# Altium schematic sheet SENSORS_FMU3_REV_C.SchDoc: Pixhawk_mini_8L.sch
size A4; Date: 18/08/2014 1:53:16 PM; DrawnBy: Philip Rowse; SheetNumber: 4; SheetTotal: 10
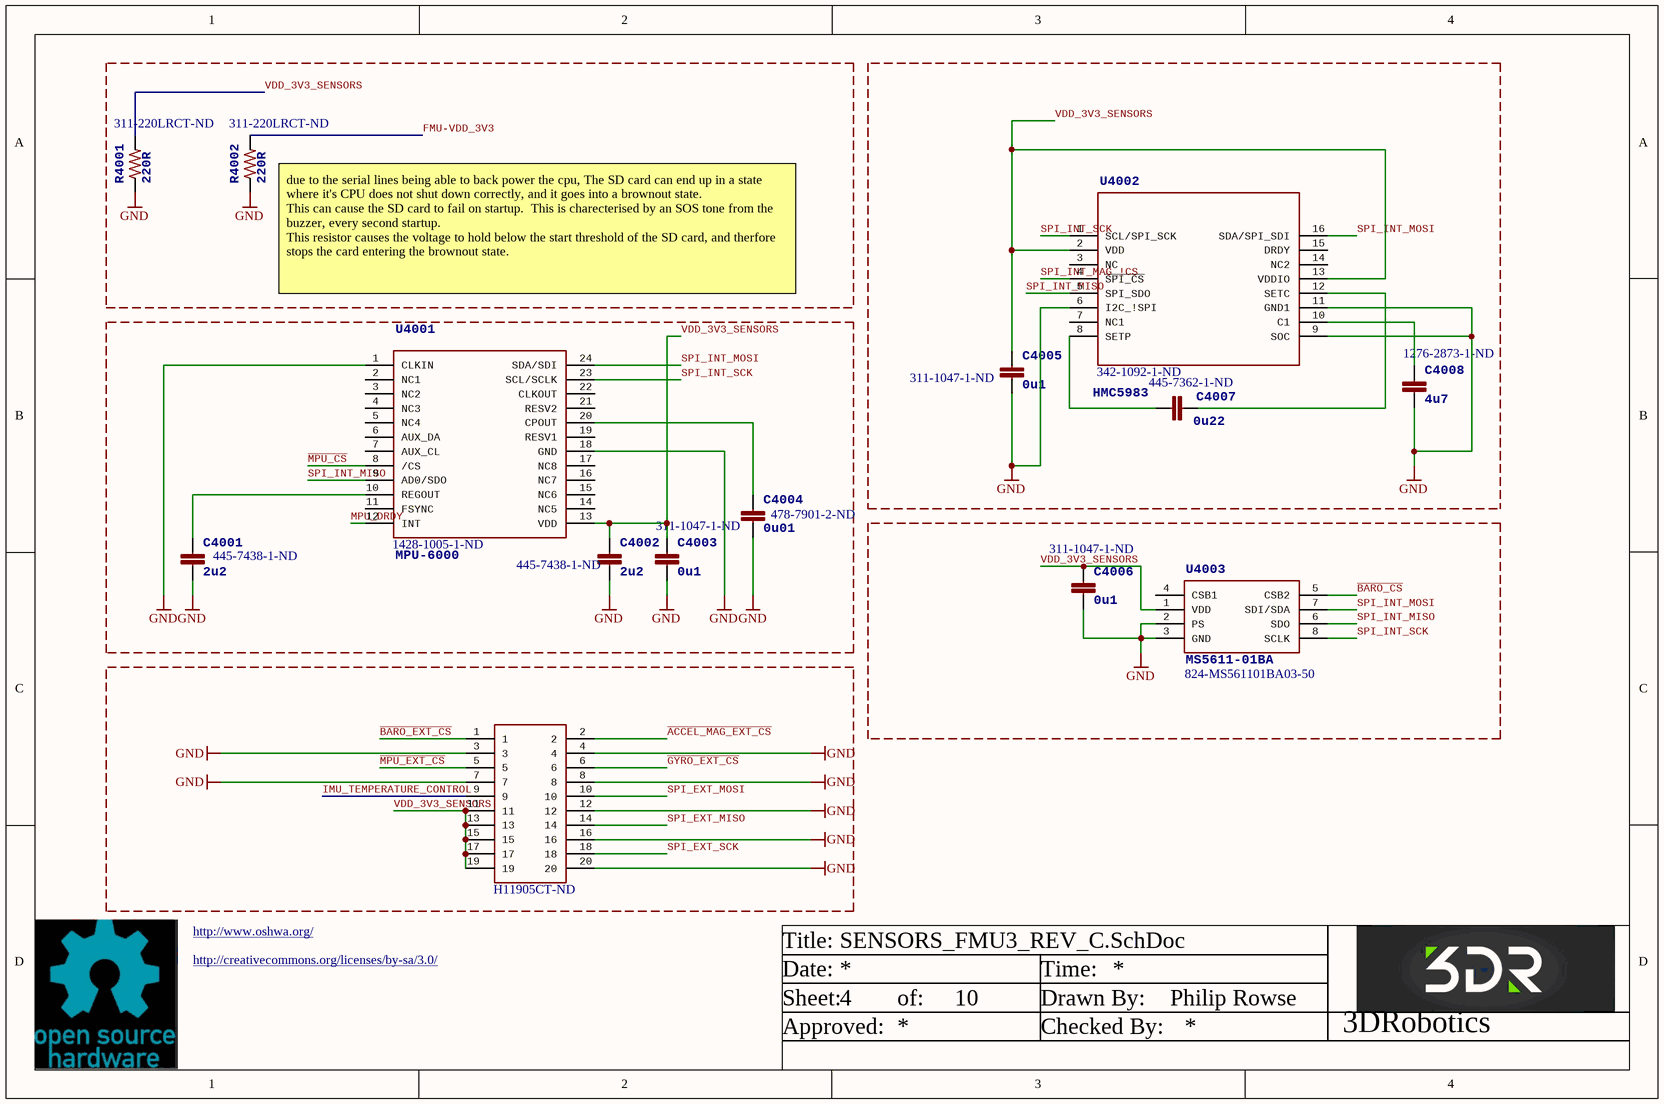
[diagram p0: SENSORS_FMU3_REV_C.SchDoc]

## Parts
C4001  2u2  Supplier Part Number 1: 445-7438-1-ND  [0603-CAP]
C4002  2u2  Supplier Part Number 1: 445-7438-1-ND  [0603-CAP]
C4003  0u1  Supplier Part Number 1: 311-1047-1-ND  [0402-CAP]
C4004  0u01  Supplier Part Number 1: 478-7901-2-ND  [0603-CAP]
C4005  0u1  Supplier Part Number 1: 311-1047-1-ND  [0402-CAP]
C4006  0u1  Supplier Part Number 1: 311-1047-1-ND  [0402-CAP]
C4007  0u22  Supplier Part Number 1: 445-7362-1-ND  [0402-CAP]
C4008  4u7  Supplier Part Number 1: 1276-2873-1-ND  [0805]
R4001  220R  Supplier Part Number 1: 311-220LRCT-ND  [0402-RES]
R4002  220R  Supplier Part Number 1: 311-220LRCT-ND  [0402-RES]
U4001  MPU-6000  Supplier Part Number 1: 1428-1005-1-ND  [QFN-24]
U4002  HMC5983  Supplier Part Number 1: 342-1092-1-ND  [HMC5983-new]
U4003  MS5611-01BA  Supplier Part Number 1: 824-MS561101BA03-50  [MS5611-01BA]
U$2  Supplier Part Number 1: H11905CT-ND  [DF-40C-20DS]  (hidden comment: DF40C-20-DS)

## Nets
GND: C4001.P$2 C4002.P$2 C4003.P$2 C4004.P$2 C4005.P$2 C4006.P$2 C4008.2 R4001.P$1 R4002.P$1 U4001.1(CLKIN) U4001.18(GND) U4002.6(I2C_!SPI) U4002.9(SOC) U4002.11(GND1) U4003.2(PS) U4003.3(GND) U$2.3 U$2.4 U$2.7 U$2.8 U$2.12 U$2.16 U$2.20
~{ACCEL_MAG_EXT_CS}: U$2.2
~{BARO_CS}: U4003.5(CSB2)
~{BARO_EXT_CS}: U$2.1
FMU-VDD_3V3: R4002.P$2
~{GYRO_EXT_CS}: U$2.6
IMU_TEMPERATURE_CONTROL: U$2.9
~{MPU_CS}: U4001.8(/CS)
~{MPU_EXT_CS}: U$2.5
MPU_DRDY: U4001.12(INT)
SPI_EXT_MISO: U$2.14
SPI_EXT_MOSI: U$2.10
SPI_EXT_SCK: U$2.18
SPI_INT_MAG_!CS: U4002.4(~{SPI_CS})
SPI_INT_MISO: U4001.9(AD0/SDO) U4002.5(SPI_SDO) U4003.6(SDO)
SPI_INT_MOSI: U4001.24(SDA/SDI) U4002.16(SDA/SPI_SDI) U4003.7(SDI/SDA)
SPI_INT_SCK: U4001.23(SCL/SCLK) U4002.1(SCL/SPI_SCK) U4003.8(SCLK)
VDD_3V3_SENSORS: C4002.P$1 C4003.P$1 C4005.P$1 C4006.P$1 R4001.P$2 U4001.13(VDD) U4002.2(VDD) U4002.13(VDDIO) U4003.1(VDD) U$2.11 U$2.13 U$2.15 U$2.17 U$2.19
NetC4001_P$1: C4001.P$1 U4001.10(REGOUT)
NetC4004_P$1: C4004.P$1 U4001.20(CPOUT)
NetC4007_P$1: C4007.P$1 U4002.12(SETC)
NetC4007_P$2: C4007.P$2 U4002.8(SETP)
NetC4008_1: C4008.1 U4002.10(C1)

Not connected (* = marked no-connect by the designer): U4001 2(NC1) 3(NC2) 4(NC3) 5(NC4) 6(AUX_DA) 7(AUX_CL) 11(FSYNC) 14(NC5) 15(NC6) 16(NC7) 17(NC8) 19(RESV1) 21(RESV2) 22(CLKOUT); U4002 3(NC) 7(NC1) 14(NC2) 15(DRDY); U4003 4(CSB1)

## Notes on the sheet
- (near R4002) due to the serial lines being able to back power the cpu, The SD card can end up in a state where it's CPU does not shut down correctly, and it goes into a brownout state.
  This can cause the SD card to fail on startup.  This is charecterised by an SOS tone from the buzzer, every second startup.
  This resistor causes the voltage to hold below the start threshold of the SD card, and therfore stops the card entering the brownout state.
- http://www.oshwa.org/
- http://creativecommons.org/licenses/by-sa/3.0/
- Title:
- Date:
- Time:
- Sheet:
- Approved:
- of:
- Drawn By:
- Checked By:
- 3DRobotics

## Library data of the parts
C4001 C4002 = CAP0603: CAP CER 2.2UF 16V 10% X6S 0603; PARTNO: C1608X6S1C225K080AC; 3DR_PARTNO: ECM0619; Supplier 1: Digi-Key; Value: 2u2
C4003 C4006 = CAP0402: CAP CER 0.1UF 16V Y5V 0402; PARTNO: CC0402ZRY5V7BB104; 3DR_PARTNO: ECM0700; Supplier 1: Digi-Key; Value: 0u1
C4004 = CAP0603: CAP CER 10000PF 25V 5% X7R 0603; PARTNO: 06033C103JAT2A; 3DR_PARTNO: ECM0620; Supplier 1: Digi-Key; Value: 0u01
C4005 = CAP0402: CAP CER 0.1UF 16V Y5V 0402; 3DR_PARTNO: ECM0700; PARTNO: CC0402ZRY5V7BB104; Supplier 1: Digi-Key; Value: 0u1
C4007 = CAP0402: CAP CER 0.22UF 25V 10% X7R 0402; 3DR_PARTNO: ECM; PARTNO: C1005X6S1E224K050BC; Value: 0u22; Supplier 1: Digi-Key
C4008 = CAP0805: CAP CER 4.7UF 16V 10% X7R 0805; PARTNO: CL21B475KOFNNNE; 3DR_PARTNO: ECM0622; DATASHEET: http://www.digikey.com/product-detail/en/CL21B475KOFNNNE/1276-2873-2-ND/3888531; Supplier 1: Digi-Key; Value: 4u7
R4001 R4002 = RESISTOR0402-RES: RES 220 OHM 1/16W 1% 0402 SMD; 3DR_PARTNO: ECM0821; PARTNO: RC0402FR-07220RL; Supplier 1: Digi-Key; Value: 220R
U4001 = MPU-6000: GYRO/ACCELEROMETER 6AXIS 24QFN; 3DR_PARTNO: ECM0834; DATASHEET: http://invensense.com/mems/gyro/documents/PS-MPU-6000A-00_v1.0.pdf; LINK: http://invensense.com/mems/gyro/mpu6000.html; MFGPN: MPU-6000; Supplier 1: Digi-Key; PARTNO: MPU-6000
U4002 = HMC5983: IC COMPASS 3 AXIS 16-LCC; 3DR_PARTNO: ECM0672; PARTNO: HMC5983; Supplier 1: Digi-Key
U4003 = MS5611-01BA: Board Mount Pressure Sensors; 3DR_PARTNO: ECM0835; Value: 10-1200mbar; DATASHEET: http://www.meas-spec.com/downloads/MS5611-01BA01.pdf; LINK: http://www.meas-spec.com/product/t_product.aspx?id=8503#; MFGPN: MS5611-01BA; PARTNO: MS5611-01BA; Supplier 1: Mouser
U$2 = DF40C-20-DS: CONN RCPT 20POS 0.4MM SMD GOLD; 3DR_PARTNO: ECM0517; PARTNO: DF40C(2.0)-20DS-0.4V(51); Supplier 1: Digi-Key